# Altium schematic sheet Analog.SchDoc
size B
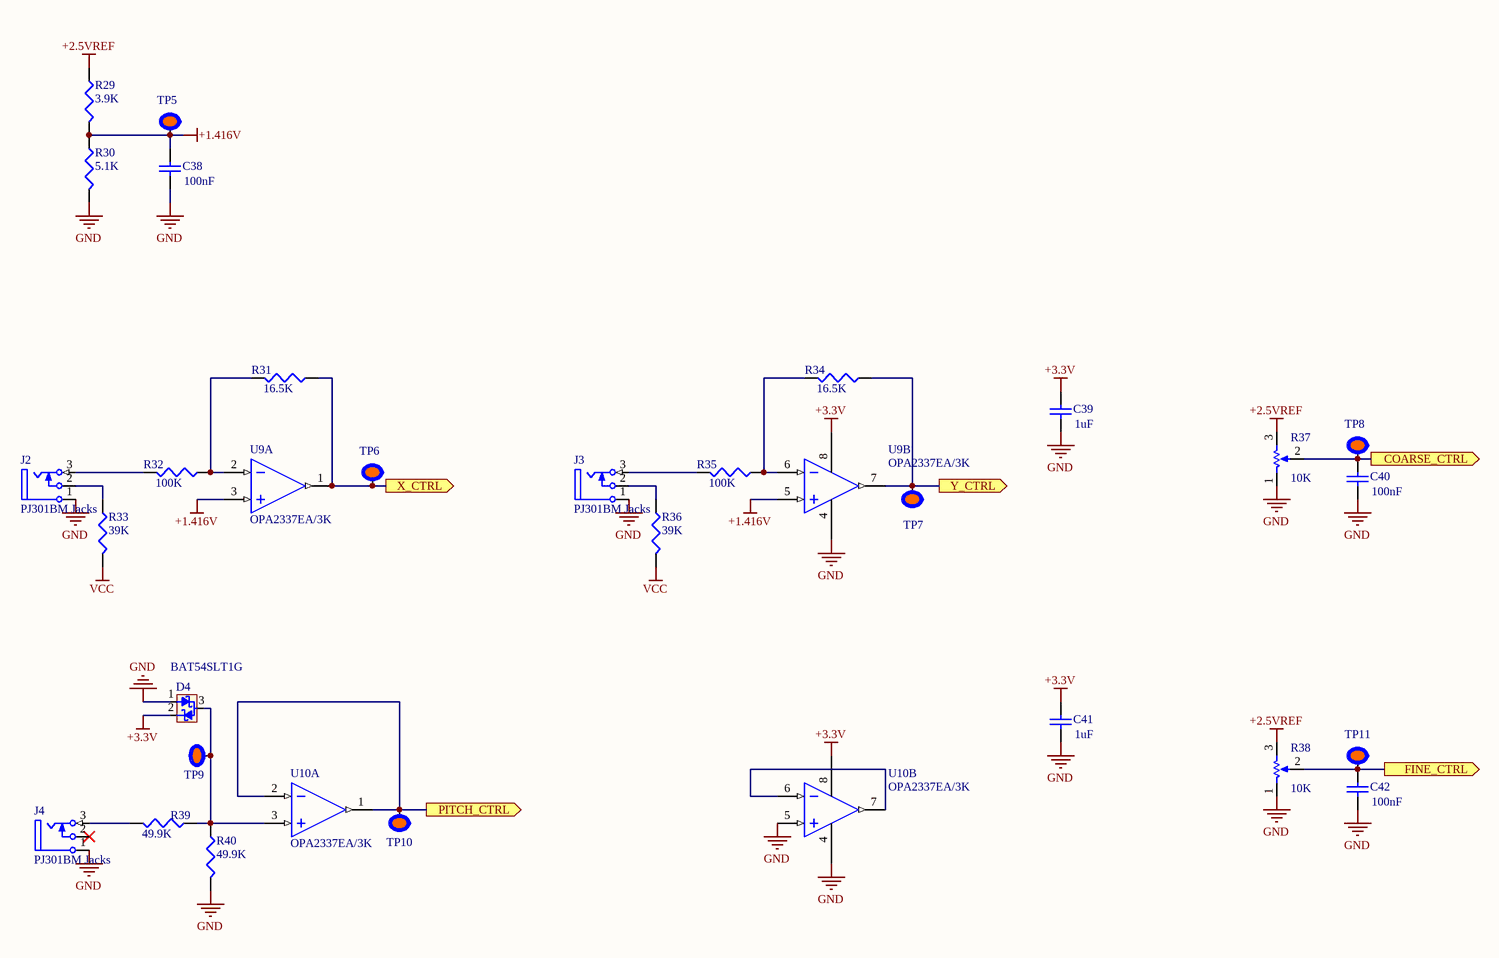
[diagram p0: Analog.SchDoc]

## Parts
C38  value 100nF  [RES_0603]  (hidden comment: 06035G104ZAT2A)
C39  value 1uF  [RES_0603]  (hidden comment: CL10A105KA8NNNC)
C40  value 100nF  [RES_0603]  (hidden comment: 06035G104ZAT2A)
C41  value 1uF  [RES_0603]  (hidden comment: CL10A105KA8NNNC)
C42  value 100nF  [RES_0603]  (hidden comment: 06035G104ZAT2A)
D4  BAT54SLT1G  [SOT23]
J2  PJ301BM Jacks  [WQP-PJ301M-12_JACK]
J3  PJ301BM Jacks  [WQP-PJ301M-12_JACK]
J4  PJ301BM Jacks  [WQP-PJ301M-12_JACK]
R29  value 3.9K  [RES_0603]  (hidden comment: ERA-3AEB392V)
R30  value 5.1K  [RES_0603]  (hidden comment: ERA-3AEB512V)
R31  value 16.5K  [RES_0603]  (hidden comment: ERA-3AEB1652V)
R32  value 100K  [RES_0603]  (hidden comment: RR0816P-104-D)
R33  value 39K  [RES_0603]  (hidden comment: ERA-3AEB393V)
R34  value 16.5K  [RES_0603]  (hidden comment: ERA-3AEB1652V)
R35  value 100K  [RES_0603]  (hidden comment: RR0816P-104-D)
R36  value 39K  [RES_0603]  (hidden comment: ERA-3AEB393V)
R37  value 10K  [P0915NEC15BR100K]  (hidden comment: P0915N-FC15BR10K)
R38  value 10K  [P0915NEC15BR100K]  (hidden comment: P0915N-FC15BR10K)
R39  value 49.9K  [RES_0603]  (hidden comment: ERA-3AEB4992V)
R40  value 49.9K  [RES_0603]  (hidden comment: ERA-3AEB4992V)
TP5  loop test point  [Test Point Mt Hole]  (value not drawn)
TP6  loop test point  [Test Point Mt Hole]  (value not drawn)
TP7  loop test point  [Test Point Mt Hole]  (value not drawn)
TP8  loop test point  [Test Point Mt Hole]  (value not drawn)
TP9  loop test point  [Test Point Mt Hole]  (value not drawn)
TP10  loop test point  [Test Point Mt Hole]  (value not drawn)
TP11  loop test point  [Test Point Mt Hole]  (value not drawn)
U9  OPA2337EA/3K  [SOT-23-8]  (parts A,B of 2)
U10  OPA2337EA/3K  [SOT-23-8]  (parts A,B of 2)

## Ports
COARSE_CTRL (out), FINE_CTRL (out), PITCH_CTRL (out), X_CTRL (out), Y_CTRL (out)

## Nets
+1.416V: C38.2 R29.2 R30.1 TP5.1 U9.3(IN_A+) U9.5(IN_B+)
+2.5VREF: R29.1 R37.3 R38.3
+3.3V: C39.2 C41.2 D4.2 U9.8 U10.8
GND: C38.1 C39.1 C40.1 C41.1 C42.1 D4.1 J2.1(S) J3.1(S) J4.1(S) R30.2 R37.1 R38.1 R40.2 U9.4 U10.4 U10.5(IN_B+)
VCC: R33.2 R36.2
COARSE_CTRL: C40.2 R37.2 TP8.1 ; port COARSE_CTRL
FINE_CTRL: C42.2 R38.2 TP11.1 ; port FINE_CTRL
PITCH_CTRL: TP10.1 U10.1(OUT_A) U10.2(IN_A-) ; port PITCH_CTRL
X_CTRL: R31.1 TP6.1 U9.1(OUT_A) ; port X_CTRL
Y_CTRL: R34.1 TP7.1 U9.7(OUT_B) ; port Y_CTRL
NetD4_3: D4.3 R39.1 R40.1 TP9.1 U10.3(IN_A+)
NetJ2_2: J2.2(TN) R33.1
NetJ2_3: J2.3(T) R32.2
NetJ3_2: J3.2(TN) R36.1
NetJ3_3: J3.3(T) R35.2
NetJ4_3: J4.3(T) R39.2
NetR31_2: R31.2 R32.1 U9.2(IN_A-)
NetR34_2: R34.2 R35.1 U9.6(IN_B-)
NetU10_6: U10.6(IN_B-) U10.7(OUT_B)

Not connected (* = marked no-connect by the designer): J4 2(TN)*

## Library data of the parts
C38 C40 C42 = Cap: Capacitor; Manufacturer: AVX Corporation; Manufacturer Part Number: 06035G104ZAT2A; Supplier 1: Digi-Key; Supplier Part Number 1: 478-3724-1-ND
C39 C41 = Cap: Capacitor; Manufacturer: Samsung Electro-Mechanics; Manufacturer Part Number: CL10A105KA8NNNC; Supplier 1: Digi-Key; Supplier Part Number 1: 1276-1102-1-ND
D4 = SCHOTTKY DIODE ARRAY: DIODE ARRAY SCHOTTKY; Manufacturer: ON Semiconductor; Supplier 1: Digi-Key; Supplier Part Number 1: BAT54SLT1GOSCT-ND; Manufacturer Part Number: BAT54SLT1G
J2-J4 = Phonejack2 TN: Jack Socket, 1/4" [6.5mm], Thru-Hole, Vertical, 2-Conductor with Tip closed; Manufacturer: Thonkiconn; Manufacturer Part Number: PJ301BM Jacks
R29-R31 R34 R39 R40 = Res3: Resistor; Manufacturer: Panasonic; Supplier 1: Digi-Key
  R29: Manufacturer Part Number: ERA-3AEB392V; Supplier Part Number 1: P3.9KDBCT-ND
  R30: Manufacturer Part Number: ERA-3AEB512V; Supplier Part Number 1: P5.1KDBCT-ND
  R31 R34: Manufacturer Part Number: ERA-3AEB1652V; Supplier Part Number 1: P16.5KDBCT-ND
  R39 R40: Manufacturer Part Number: ERA-3AEB4992V; Supplier Part Number 1: P49.9KDBTR-ND
R32 R35 = Res3: Resistor; Manufacturer: Susumu; Manufacturer Part Number: RR0816P-104-D; Supplier 1: Digi-Key; Supplier Part Number 1: RR08P100KDCT-ND
R33 R36 = Res3: Manufacturer: Panasonic Electronic Components; Manufacturer Part Number: ERA-3AEB393V; Supplier 1: Digi-Key; Supplier Part Number 1: P39KDBCT-ND
R37 R38 = RPot: Potentiometer; Manufacturer: TT Electronics/BI; Manufacturer Part Number: P0915N-FC15BR10K; Supplier 1: Digi-Key; Supplier 1 Part Number: 987-1649-ND
TP5-TP11 = 402046: Test Point Loop Miniature Keysone; Manufacturer: Keystone Electronics; Manufacturer Part Number: 5003; Supplier 1: Digi-Key; Supplier Part Number 1: 36-5003-ND
U9 U10 = OPA2137E/2K5: Low Cost FET-Input Operational Amplifier, 4.5 to 36 V, -40 to 85 degC, 8-pin SOP (DGK8), Green (RoHS & no Sb/Br); Manufacturer: Texas Instruments; Manufacturer Part Number: OPA2337EA/3K; Supplier 1: Digi-Key; Supplier Part Number 1: 296-26252-1-ND